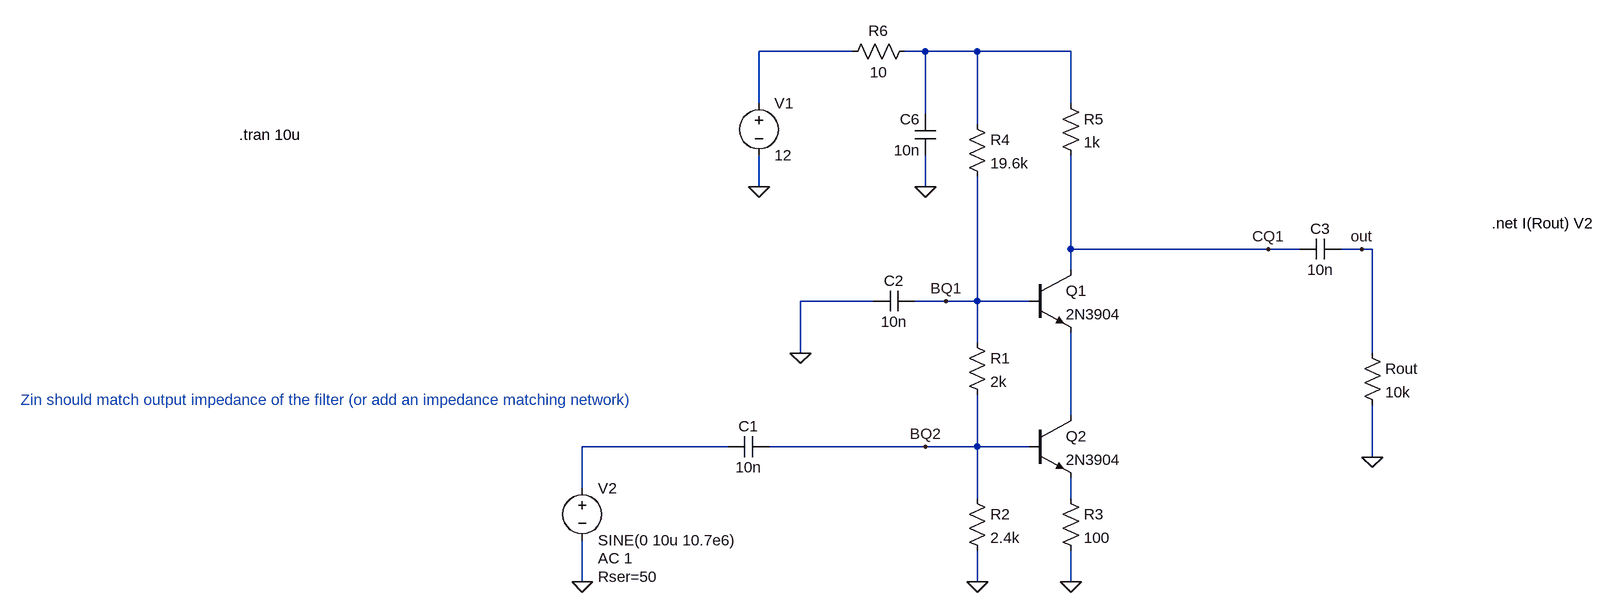
[diagram p0: schematic cascode_test.asc]
cascode_test.asc, the LTspice schematic file:
Version 4
SHEET 1 1304 680
WIRE 144 -208 0 -208
WIRE 256 -208 224 -208
WIRE 336 -208 256 -208
WIRE 480 -208 336 -208
WIRE 0 -128 0 -208
WIRE 480 -128 480 -208
WIRE 256 -112 256 -208
WIRE 336 -96 336 -208
WIRE 0 0 0 -48
WIRE 256 0 256 -48
WIRE 480 96 480 -48
WIRE 784 96 480 96
WIRE 832 96 784 96
WIRE 928 96 896 96
WIRE 944 96 928 96
WIRE 480 128 480 96
WIRE 176 176 64 176
WIRE 288 176 240 176
WIRE 336 176 336 -16
WIRE 336 176 288 176
WIRE 416 176 336 176
WIRE 336 240 336 176
WIRE 64 256 64 176
WIRE 944 256 944 96
WIRE 480 352 480 224
WIRE -48 400 -272 400
WIRE 256 400 16 400
WIRE 336 400 336 320
WIRE 336 400 256 400
WIRE 416 400 336 400
WIRE 944 416 944 336
WIRE -272 464 -272 400
WIRE 336 480 336 400
WIRE 480 480 480 448
WIRE -272 608 -272 544
WIRE 336 608 336 560
WIRE 480 608 480 560
FLAG 0 0 0
FLAG 336 608 0
FLAG 480 608 0
FLAG -272 608 0
FLAG 64 256 0
FLAG 256 400 BQ2
FLAG 784 96 CQ1
FLAG 288 176 BQ1
FLAG 944 416 0
FLAG 928 96 out
FLAG 256 0 0
SYMBOL npn 416 128 R0
SYMATTR InstName Q1
SYMATTR Value 2N3904
SYMBOL npn 416 352 R0
SYMATTR InstName Q2
SYMATTR Value 2N3904
SYMBOL res 320 224 R0
SYMATTR InstName R1
SYMATTR Value 2k
SYMBOL res 320 464 R0
SYMATTR InstName R2
SYMATTR Value 2.4k
SYMBOL res 464 464 R0
SYMATTR InstName R3
SYMATTR Value 100
SYMBOL cap 16 384 R90
WINDOW 0 0 32 VBottom 2
WINDOW 3 32 32 VTop 2
SYMATTR InstName C1
SYMATTR Value 10n
SYMBOL voltage 0 -144 R0
WINDOW 123 0 0 Left 0
WINDOW 39 0 0 Left 0
SYMATTR InstName V1
SYMATTR Value 12
SYMBOL voltage -272 448 R0
WINDOW 123 24 124 Left 2
WINDOW 39 24 152 Left 2
SYMATTR Value2 AC 1
SYMATTR SpiceLine Rser=50
SYMATTR InstName V2
SYMATTR Value SINE(0 10u 10.7e6)
SYMBOL res 320 -112 R0
SYMATTR InstName R4
SYMATTR Value 19.6k
SYMBOL cap 240 160 R90
WINDOW 0 0 32 VBottom 2
WINDOW 3 32 32 VTop 2
SYMATTR InstName C2
SYMATTR Value 10n
SYMBOL res 928 240 R0
SYMATTR InstName Rout
SYMATTR Value 10k
SYMBOL cap 896 80 R90
WINDOW 0 0 32 VBottom 2
WINDOW 3 32 32 VTop 2
SYMATTR InstName C3
SYMATTR Value 10n
SYMBOL res 464 -144 R0
SYMATTR InstName R5
SYMATTR Value 1k
SYMBOL res 240 -224 R90
WINDOW 0 0 56 VBottom 2
WINDOW 3 32 56 VTop 2
SYMATTR InstName R6
SYMATTR Value 10
SYMBOL cap 272 -48 R180
WINDOW 0 24 56 Left 2
WINDOW 3 24 8 Left 2
SYMATTR InstName C6
SYMATTR Value 10n
TEXT 1128 56 Left 2 !.net I(Rout) V2
TEXT -800 -80 Left 2 !.tran 10u
TEXT -1136 328 Left 2 ;Zin should match output impedance of the filter (or add an impedance matching network)

The netlist it stands for:
* cascode_test.asc
Q1 CQ1 BQ1 N003 0 2N3904
Q2 N003 BQ2 N005 0 2N3904
R1 BQ1 BQ2 2k
R2 BQ2 0 2.4k
R3 N005 0 100
C1 BQ2 N004 10n
V1 N001 0 12
V2 N004 0 SINE(0 10u 10.7e6) AC 1 Rser=50
R4 N002 BQ1 19.6k
C2 BQ1 0 10n
Rout out 0 10k
C3 out CQ1 10n
R5 N002 CQ1 1k
R6 N002 N001 10
C6 0 N002 10n
.model NPN NPN
.model PNP PNP
.lib standard.bjt
.net I(Rout) V2
.tran 10u
* Zin should match output impedance of the filter (or add an impedance matching network)
.backanno
.end